# Altium schematic sheet ExtConn.SchDoc
size A4
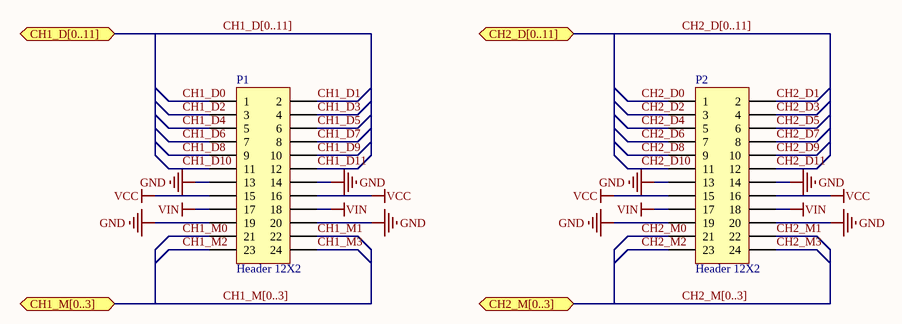
[diagram p0: ExtConn.SchDoc]

## Parts
P1  Header 12X2  [HDR2X12]
P2  Header 12X2  [HDR2X12]

## Ports
CH1_D[0..11] (bidir), CH1_M[0..3] (bidir), CH2_D[0..11] (bidir), CH2_M[0..3] (bidir)

## Nets
GND: P1.13 P1.14 P1.19 P1.20 P2.13 P2.14 P2.19 P2.20
VCC: P1.15 P1.16 P2.15 P2.16
VIN: P1.17 P1.18 P2.17 P2.18
CH1_D0: P1.1
CH1_D1: P1.2
CH1_D2: P1.3
CH1_D3: P1.4
CH1_D4: P1.5
CH1_D5: P1.6
CH1_D6: P1.7
CH1_D7: P1.8
CH1_D8: P1.9
CH1_D9: P1.10
CH1_D10: P1.11
CH1_D11: P1.12
CH1_M0: P1.21
CH1_M1: P1.22
CH1_M2: P1.23
CH1_M3: P1.24
CH2_D0: P2.1
CH2_D1: P2.2
CH2_D2: P2.3
CH2_D3: P2.4
CH2_D4: P2.5
CH2_D5: P2.6
CH2_D6: P2.7
CH2_D7: P2.8
CH2_D8: P2.9
CH2_D9: P2.10
CH2_D10: P2.11
CH2_D11: P2.12
CH2_M0: P2.21
CH2_M1: P2.22
CH2_M2: P2.23
CH2_M3: P2.24

## Buses and harness runs
bus CH1_D[0..11] = port CH1_D[0..11]
bus CH1_M[0..3] = port CH1_M[0..3]
bus CH2_D[0..11] = port CH2_D[0..11]
bus CH2_M[0..3] = port CH2_M[0..3]

## Library data of the parts
P1 P2 = Header 12X2: Header, 12-Pin, Dual row; LatestRevisionDate: 17-Jul-2002; LatestRevisionNote: Re-released for DXP Platform.; Publisher: Altium Limited